# EAGLE schematic battery-check-6V (EAGLE 5.07)
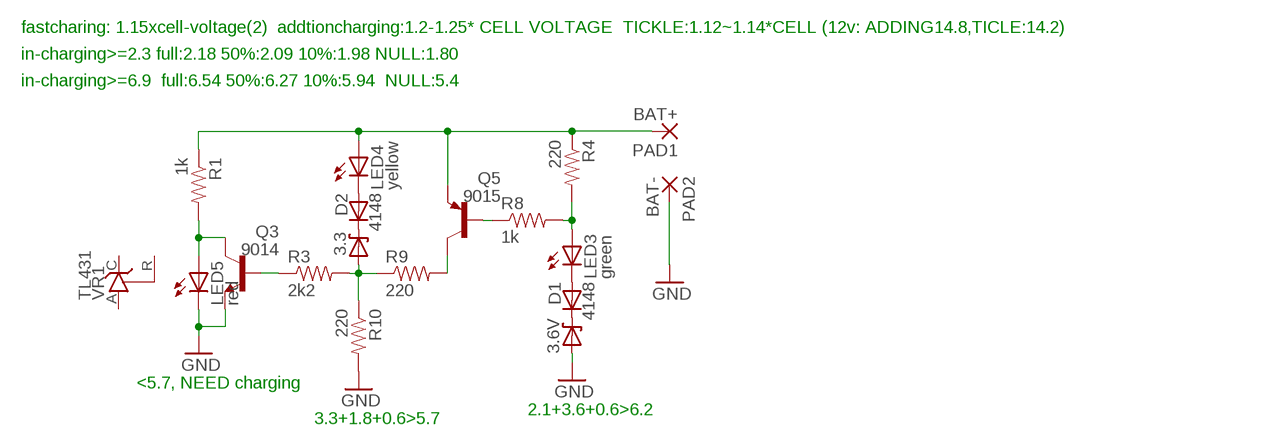
[diagram p0: schematic, sheet 1]

## Parts
3.3  DIODE-ZENERPTH  [DIODE-ZENER]
3.6V  DIODE-ZENERPTH  [DIODE-ZENER]
D1  4148  DIODE1N4148  [DIODE-1N4148]
D2  4148  DIODE1N4148  [DIODE-1N4148]
LED3  green  LED3MM  [LED3MM]
LED4  yellow  LED3MM  [LED3MM]
LED5  red  LED3MM  [LED3MM]
PAD1  BAT+  2,54/1,0  [2,54/1,0]
PAD2  BAT-  2,54/1,0  [2,54/1,0]
Q3  9014  -NPN-TO92-EBC  [TO92-EBC]
Q5  9015  -PNP-TO92-EBC  [TO92-EBC]
R1  1k  RESISTOR1/4W  [AXIAL-0.3]
R3  2k2  RESISTOR1/4W  [AXIAL-0.3]
R4  220  RESISTOR1/4W  [AXIAL-0.3]
R8  1k  RESISTOR1/4W  [AXIAL-0.3]
R9  220  RESISTOR1/4W  [AXIAL-0.3]
R10  220  RESISTOR1/4W  [AXIAL-0.3]
VR1  TL431  TL431CLP  [TO92-CLP]

## Nets
GND: 3.6V.P$2(A) LED5.K(C) PAD2.1(P) Q3.E R10.P$2
N$1: LED4.A PAD1.1(P) Q5.E R1.P$1 R4.P$1
N$2: D2.A LED4.K(C)
N$3: 3.3.P$2(A) R3.P$2 R9.P$1 R10.P$1
N$4: Q3.B R3.P$1
N$5: LED5.A Q3.C R1.P$2
N$6: D1.A LED3.K(C)
N$7: 3.6V.P$1(C) D1.C
N$8: Q5.C R9.P$2
N$9: Q5.B R8.P$1
N$10: LED3.A R4.P$2 R8.P$2
N$11: 3.3.P$1(C) D2.C
Unconnected: VR1.A VR1.C VR1.R

## Notes on the sheet
- fastcharing: 1.15xcell-voltage(2)  addtioncharging:1.2-1.25* CELL VOLTAGE  TICKLE:1.12~1.14*CELL (12v: ADDING14.8,TICLE:14.2)
- in-charging>=2.3 full:2.18 50%:2.09 10%:1.98 NULL:1.80
- in-charging>=6.9  full:6.54 50%:6.27 10%:5.94  NULL:5.4
- <5.7, NEED charging
- 2.1+3.6+0.6>6.2
- 3.3+1.8+0.6>5.7

## Library data of the parts
3.3 3.6V = SparkFun:DIODE-ZENER: Zener Diode Production Part - 8199 3.4V Zener Voltage
D1 D2 = SparkFun:DIODE: Diode These are standard reverse protection diodes and small signal diodes. SMA package can handle up to about 1A. SOD-323 can handle about 200mA. What the SOD-323 package when ordering, there are some mfgs out there that are 5-pin packages.
LED3-LED5 = digital-toy:LED: LEDs Standard schematic elements and footprints for 5mm, 3mm, 1206, and 0603 sized LEDs. 5mm - Spark Fun Electronics SKU : COM-00529 (and others)
PAD1 PAD2 = wirepad:2,54/1,0: THROUGH-HOLE PAD
Q3 = digital-toy:*-NPN-: NPN Transistror
Q5 = digital-toy:*-PNP-: PNP Transistror
R1 R3 R4 R8-R10 = digital-toy:RESISTOR: Resistor Basic schematic elements and footprints for 0603, 1206, and PTH 1/10th watt (small) resistors.
VR1 = v-reg:TL431CLP: VOLTAGE REGULATOR